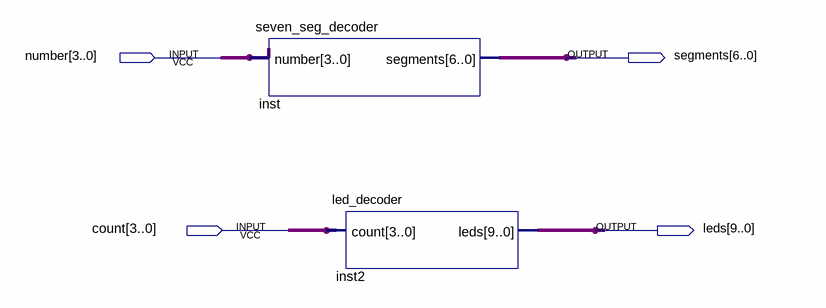
[diagram p0: schematic sheet]
// Quartus schematic lab1_top_level_lest.bdf as structural Verilog: 2 symbols, 4 pins
module lab1_top_level_lest (
  input  [3:0] number,
  input  [3:0] count,
  output [6:0] segments,
  output [9:0] leds
);

  seven_seg_decoder inst (.number(number), .segments(segments));
  led_decoder inst2 (.count(count), .leds(leds));
endmodule
